# EAGLE schematic latch (EAGLE 7.5.0)
IMD and BMS latching board.
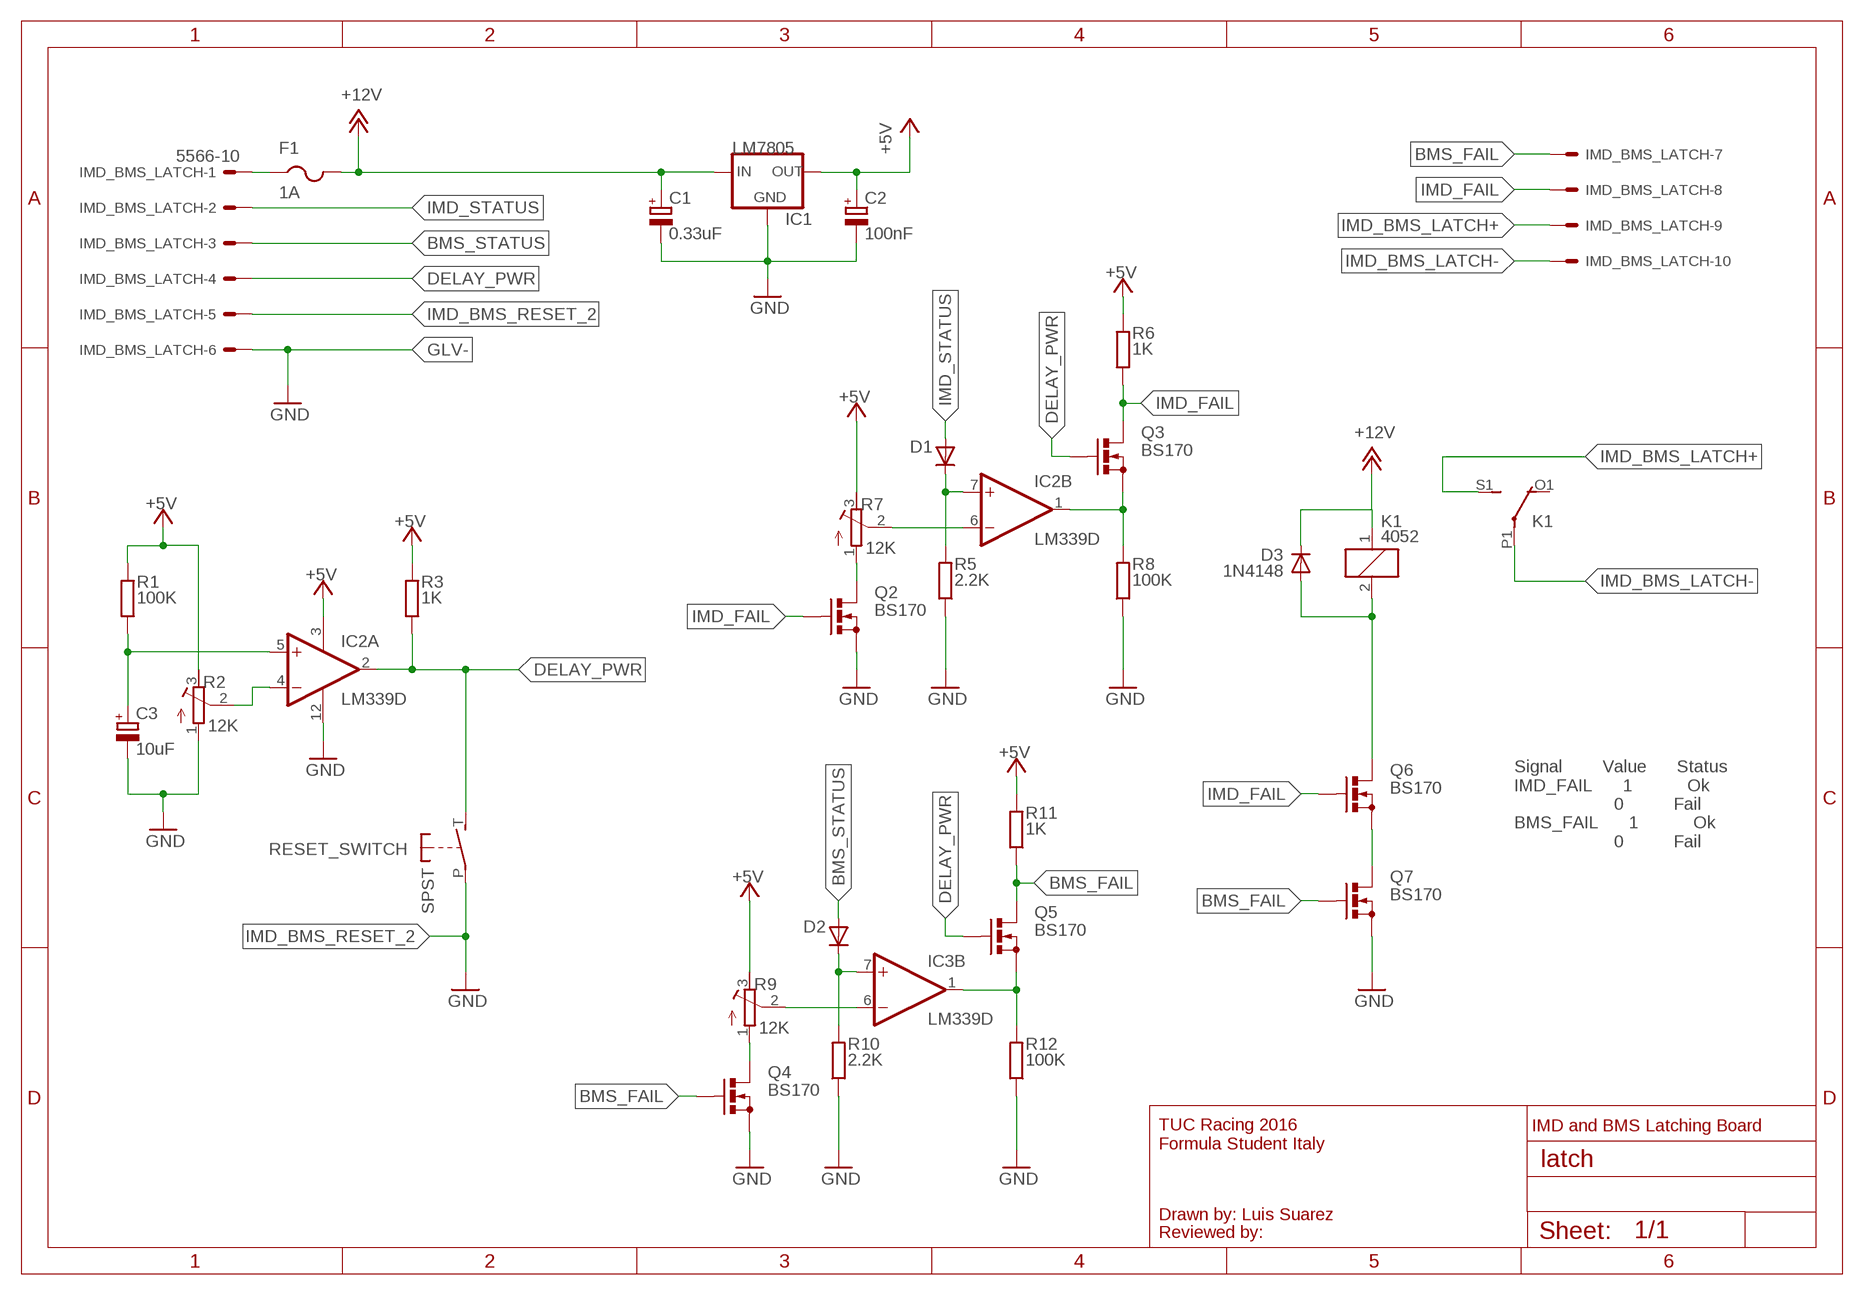
[diagram p0: schematic, sheet 1]

## Parts
C1  0.33uF  CPOL-EU140CLH-1010  [140CLH-1010]
C2  100nF  CPOL-EU140CLH-1010  [140CLH-1010]
C3  10uF  CPOL-EU140CLH-0810  [140CLH-0810]
D1  DIODE-DO-214AC  [DO-214AC]
D2  DIODE-DO-214AC  [DO-214AC]
D3  1N4148  DIODE-DO-214AC  [DO-214AC]
F1  1A  PTCFUSE-1812  [1812]
IC1  LM7805  78XX-TO3  [TO3-78]
IC2  LM339D  [SO14]
IC3  LM339D  [SO14]
IMD_BMS_LATCH  5566-10  [5566-10]
K1  4052  [F4052]
Q2  BS170  [SOT54E]
Q3  BS170  [SOT54E]
Q4  BS170  [SOT54E]
Q5  BS170  [SOT54E]
Q6  BS170  [SOT54E]
Q7  BS170  [SOT54E]
R1  100K  R-EU_R1206  [R1206]
R2  12K  R-TRIMM64Y  [RTRIM64Y]
R3  1K  R-EU_R1206  [R1206]
R5  2.2K  R-EU_R1206  [R1206]
R6  1K  R-EU_R1206  [R1206]
R7  12K  R-TRIMM64Y  [RTRIM64Y]
R8  100K  R-EU_R1206  [R1206]
R9  12K  R-TRIMM64Y  [RTRIM64Y]
R10  2.2K  R-EU_R1206  [R1206]
R11  1K  R-EU_R1206  [R1206]
R12  100K  R-EU_R1206  [R1206]
RESET_SWITCH  SPST  [JUDCOSPST]

## Nets
+5V: C2.+ IC1.1(OUT) IC2.3(P:V+) R1.2 R2.3(E) R3.2 R6.2 R7.3(E) R9.3(E) R11.2
+12V: D3.C K1.1
BMS_FAIL: IMD_BMS_LATCH.7 Q4.G Q5.D Q7.G R11.1
BMS_STATUS: D2.A IMD_BMS_LATCH.3
DELAY_PWR: IC2.2(A:OUT) IMD_BMS_LATCH.4 Q3.G Q5.G R3.1 RESET_SWITCH.T(S)
GLV+: C1.+ F1.2 IC1.2(IN) ; supply symbol labelled +12V
GLV-: IMD_BMS_LATCH.6 ; supply symbol labelled GND
GND: C1.- C2.- C3.- IC1.3(GND) IC2.12(P:GND) Q2.S Q4.S Q7.S R2.1(A) R5.1 R8.1 R10.1 R12.1
IMD_BMS_LATCH+: IMD_BMS_LATCH.9 K1.S1(2:S)
IMD_BMS_LATCH-: IMD_BMS_LATCH.10 K1.P1(2:P)
IMD_BMS_RESET_2: IMD_BMS_LATCH.5 RESET_SWITCH.P ; supply symbol labelled GND
IMD_FAIL: IMD_BMS_LATCH.8 Q2.G Q3.D Q6.G R6.1
IMD_STATUS: D1.A IMD_BMS_LATCH.2
N$1: F1.1 IMD_BMS_LATCH.1
N$2: IC2.4(A:-IN) R2.2(S)
N$3: C3.+ IC2.5(A:+IN) R1.1
N$5: D1.C IC2.7(B:+IN) R5.2
N$6: IC2.6(B:-IN) R7.2(S)
N$7: Q2.D R7.1(A)
N$8: D2.C IC3.7(B:+IN) R10.2
N$9: IC2.1(B:OUT) Q3.S R8.2
N$10: IC3.6(B:-IN) R9.2(S)
N$11: Q4.D R9.1(A)
N$12: IC3.1(B:OUT) Q5.S R12.2
N$13: D3.A K1.2 Q6.D
N$14: Q6.S Q7.D
Unconnected: IC2.8(C:-IN) IC2.9(C:+IN) IC2.10(D:-IN) IC2.11(D:+IN) IC2.13(D:OUT) IC2.14(C:OUT) IC3.2(A:OUT) IC3.4(A:-IN) IC3.5(A:+IN) IC3.8(C:-IN) IC3.9(C:+IN) IC3.10(D:-IN) IC3.11(D:+IN) IC3.13(D:OUT) IC3.14(C:OUT) K1.O1(2:O) K1.O2(3:O) K1.P2(3:P) K1.S2(3:S)

## Notes on the sheet
- Signal        Value      Status
  IMD_FAIL      1           Ok
                      0          Fail
  BMS_FAIL      1           Ok
                      0          Fail
- IMD and BMS Latching Board
- TUC Racing 2016
  Formula Student Italy
- Drawn by: Luis Suarez
- Reviewed by:

## Power pins joined to a net without a drawn wire
GND: IC3.12(P:GND)
V+: IC3.3(P:V+)

## Library data of the parts
C1-C3 = rcl:CPOL-EU: POLARIZED CAPACITOR, European symbol
D1-D3 = diode:DIODE-: DIODE
F1 = adafruit:PTCFUSE: PTC fuses, resettable thermistors
IC1 = v-reg:78XX-TO3: VOLTAGE REGULATOR
IC2 IC3 = linear:LM339: Low Power Low Offset Voltage Quad Comparators with open collector; LM139/LM239/LM339/LM2901/LM3302
IMD_BMS_LATCH = con-molex:5566-10: Mini FIT connector 10 pol Source: http://www.molex.com; OC_FARNELL: unknown; OC_NEWARK: unknown
K1 = relay:4052: RELAY 2 x switch, Finder; OC_FARNELL: unknown; OC_NEWARK: unknown
Q2-Q7 = transistor-small-signal:BS170: N-CHANNEL MOS FET
R1 R3 R5 R6 R8 R10-R12 = rcl:R-EU_: RESISTOR, European symbol
R2 R7 R9 = rcl:R-TRIMM: Trimm resistor
RESET_SWITCH = adafruit:SPST: Judco 50-0015-00